# Altium project Nixie_Clock_2_1.PrjPcb
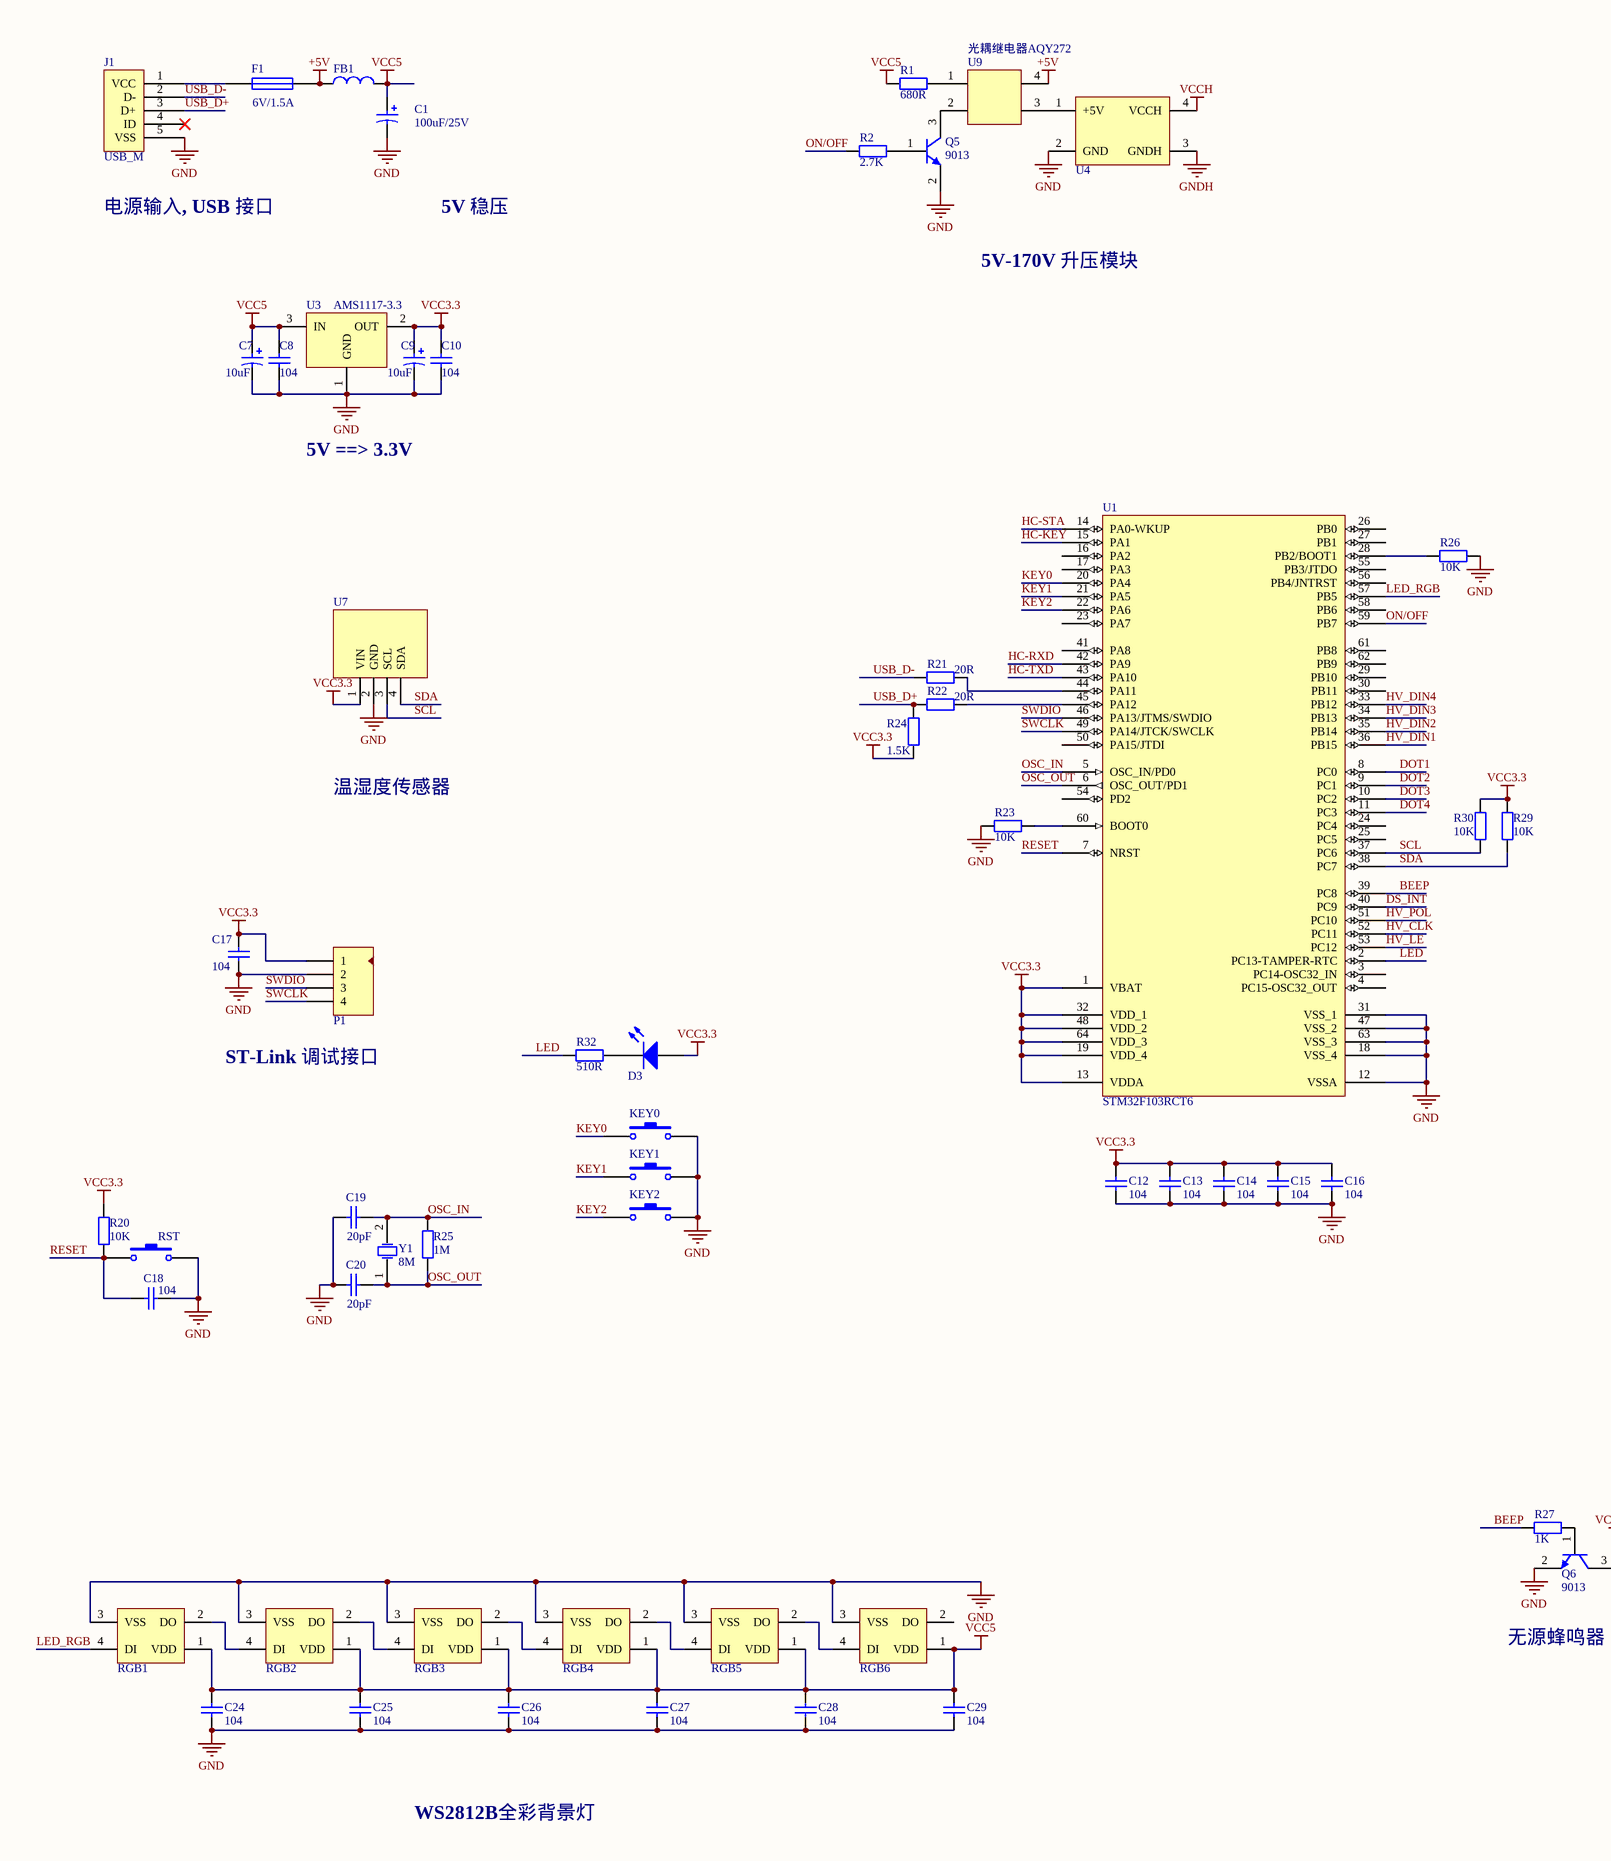
[diagram p0: SCH.SchDoc, left]
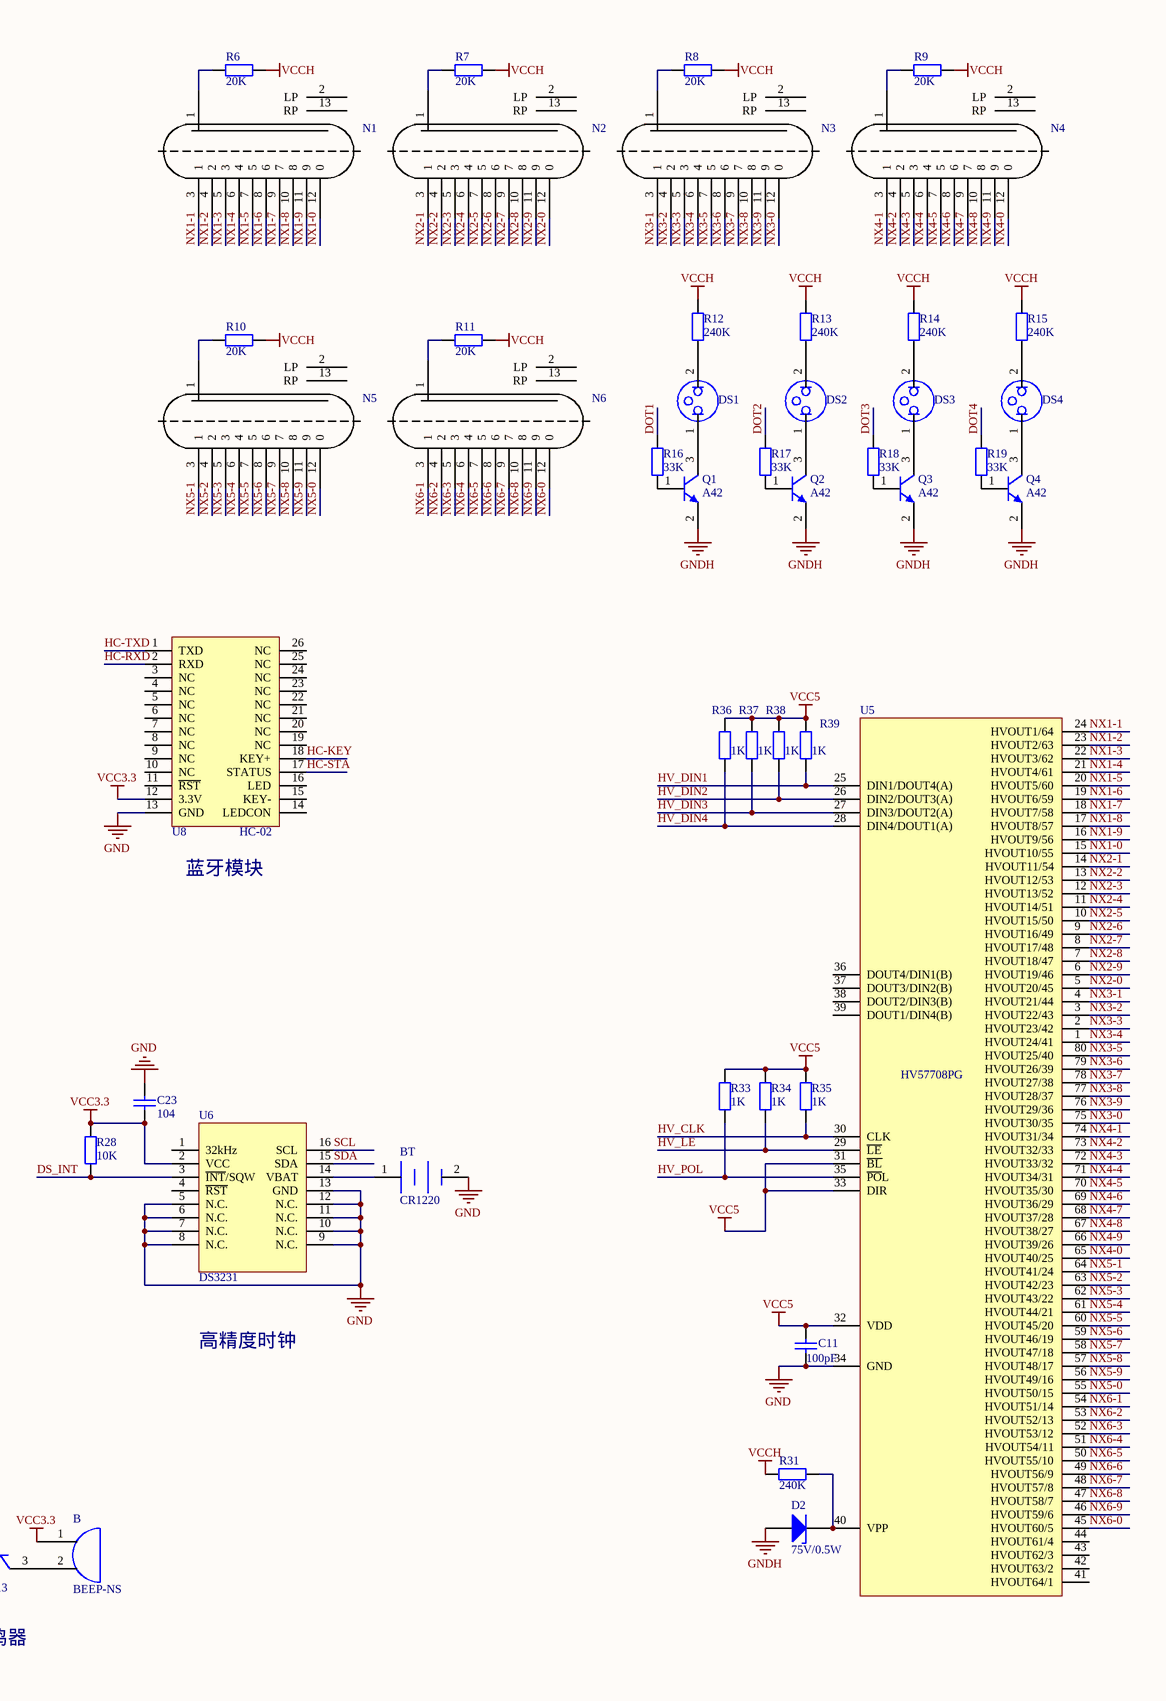
[diagram p1: SCH.SchDoc, right]
1 sheet, 101 parts. Net scope: global (net labels, ports and power ports of the same name join across sheets).
Board file: PCB.PcbDoc

## Sheet SCH.SchDoc
size A2

### Parts
B  BEEP-NS  [BEEP-NS]
BT  Battery  [CR1220]  (value not drawn)
C1  value 100uF/25V  [C-RB-SMD6.3x7.7]  (hidden comment: Cap-Pol-ES)
C7  value 10uF  [C-1210]  (hidden comment: Cap-Pol)
C8  value 104  [C-0805]  (hidden comment: Cap-S)
C9  value 10uF  [C-1210]  (hidden comment: Cap-Pol)
C10  value 104  [C-0805]  (hidden comment: Cap-S)
C11  value 100pF  [C-0805]  (hidden comment: Cap-S)
C12  value 104  [C-0805]  (hidden comment: Cap-S)
C13  value 104  [C-0805]  (hidden comment: Cap-S)
C14  value 104  [C-0805]  (hidden comment: Cap-S)
C15  value 104  [C-0805]  (hidden comment: Cap-S)
C16  value 104  [C-0805]  (hidden comment: Cap-S)
C17  value 104  [C-0805]  (hidden comment: Cap-S)
C18  value 104  [C-0805]  (hidden comment: Cap-S)
C19  value 20pF  [C-0805]  (hidden comment: Cap-S)
C20  value 20pF  [C-0805]  (hidden comment: Cap-S)
C23  value 104  [C-0805]  (hidden comment: Cap-S)
C24  value 104  [C-0805]  (hidden comment: Cap-S)
C25  value 104  [C-0805]  (hidden comment: Cap-S)
C26  value 104  [C-0805]  (hidden comment: Cap-S)
C27  value 104  [C-0805]  (hidden comment: Cap-S)
C28  value 104  [C-0805]  (hidden comment: Cap-S)
C29  value 104  [C-0805]  (hidden comment: Cap-S)
D2  value 75V/0.5W  [D-ll34]  (hidden comment: ZMM75)
D3  LED0  [LED-0805]  (value not drawn)
DS1  Neon  [PIN2]  (value not drawn)
DS2  Neon  [PIN2]  (value not drawn)
DS3  Neon  [PIN2]  (value not drawn)
DS4  Neon  [PIN2]  (value not drawn)
F1  value 6V/1.5A  [1206]  (hidden comment: Fuse1)
FB1  Inductor  [0805-1]  (value not drawn)
J1  USB_M  [USB_MICRO]
KEY0  KEY  [SW_PB2_C1]  (value not drawn)
KEY1  KEY  [SW_PB2_C1]  (value not drawn)
KEY2  KEY  [SW_PB2_C1]  (value not drawn)
N1  IN_14  [IN_14]  (value not drawn)
N2  IN_14  [IN_14]  (value not drawn)
N3  IN_14  [IN_14]  (value not drawn)
N4  IN_14  [IN_14]  (value not drawn)
N5  IN_14  [IN_14]  (value not drawn)
N6  IN_14  [IN_14]  (value not drawn)
P1  Header 4  [HDR4X1-2.54]  (value not drawn)
Q1  A42  [SOT23-3]
Q2  A42  [SOT23-3]
Q3  A42  [SOT23-3]
Q4  A42  [SOT23-3]
Q5  9013  [SOT23-3]
Q6  9013  [SOT23-3]
R1  value 680R  [0805-1]  (hidden comment: Res1)
R2  value 2.7K  [0805-1]  (hidden comment: Res1)
R6  value 20K  [0805-1]  (hidden comment: Res1)
R7  value 20K  [0805-1]  (hidden comment: Res1)
R8  value 20K  [0805-1]  (hidden comment: Res1)
R9  value 20K  [0805-1]  (hidden comment: Res1)
R10  value 20K  [0805-1]  (hidden comment: Res1)
R11  value 20K  [0805-1]  (hidden comment: Res1)
R12  value 240K  [0805-1]  (hidden comment: Res1)
R13  value 240K  [0805-1]  (hidden comment: Res1)
R14  value 240K  [0805-1]  (hidden comment: Res1)
R15  value 240K  [0805-1]  (hidden comment: Res1)
R16  value 33K  [0805-1]  (hidden comment: Res1)
R17  value 33K  [0805-1]  (hidden comment: Res1)
R18  value 33K  [0805-1]  (hidden comment: Res1)
R19  value 33K  [0805-1]  (hidden comment: Res1)
R20  value 10K  [0805-1]  (hidden comment: Res1)
R21  value 20R  [0805-1]  (hidden comment: Res1)
R22  value 20R  [0805-1]  (hidden comment: Res1)
R23  value 10K  [0805-1]  (hidden comment: Res1)
R24  value 1.5K  [0805-1]  (hidden comment: Res1)
R25  value 1M  [0805-1]  (hidden comment: Res1)
R26  value 10K  [0805-1]  (hidden comment: Res1)
R27  value 1K  [0805-1]  (hidden comment: Res1)
R28  value 10K  [0805-1]  (hidden comment: Res1)
R29  value 10K  [0805-1]  (hidden comment: Res1)
R30  value 10K  [0805-1]  (hidden comment: Res1)
R31  value 240K  [0805-1]  (hidden comment: Res1)
R32  value 510R  [0805-1]  (hidden comment: Res1)
R33  value 1K  [0805-1]  (hidden comment: Res1)
R34  value 1K  [0805-1]  (hidden comment: Res1)
R35  value 1K  [0805-1]  (hidden comment: Res1)
R36  value 1K  [0805-1]  (hidden comment: Res1)
R37  value 1K  [0805-1]  (hidden comment: Res1)
R38  value 1K  [0805-1]  (hidden comment: Res1)
R39  value 1K  [0805-1]  (hidden comment: Res1)
RGB1  WS2812B  [SMD-5050-4]  (value not drawn)
RGB2  WS2812B  [SMD-5050-4]  (value not drawn)
RGB3  WS2812B  [SMD-5050-4]  (value not drawn)
RGB4  WS2812B  [SMD-5050-4]  (value not drawn)
RGB5  WS2812B  [SMD-5050-4]  (value not drawn)
RGB6  WS2812B  [SMD-5050-4]  (value not drawn)
RST  SW-PB  [SW_PB2_A1]  (value not drawn)
U1  STM32F103RCT6  [LQFP-64]
U3  AMS1117-3.3  [SOT223]
U4  Boost  [BOOST-A]  (value not drawn)
U5  HV57708PG  [PQFP-80]
U6  DS3231  [SOIC-16W]
U7  SHT30  [SHT30]  (value not drawn)
U8  HC-02  [HC-02]
U9  光耦继电器AQY272  [AQY272-SOP]
Y1  value 8M  [X-SM49]  (hidden comment: XTAL)

### Nets
+5V: F1.2 FB1.1 U9.4
GND: BT.2 C1.2 C7.2 C8.2 C9.2 C10.2 C11.2 C12.1 C13.1 C14.1 C15.1 C16.1 C17.2 C18.2 C19.1 C20.1 C23.2 C24.2 C25.2 C26.2 C27.2 C28.2 C29.2 J1.5(VSS) KEY0.2 KEY1.2 KEY2.2 P1.2 Q5.2(E) Q6.2(E) R23.1 R26.2 RGB1.3(VSS) RGB2.3(VSS) RGB3.3(VSS) RGB4.3(VSS) RGB5.3(VSS) RGB6.3(VSS) RST.2 U1.12(VSSA) U1.18(VSS_4) U1.31(VSS_1) U1.47(VSS_2) U1.63(VSS_3) U3.1(GND) U4.2(GND) U5.34(GND) U6.5(N.C.) U6.6(N.C.) U6.7(N.C.) U6.8(N.C.) U6.9(N.C.) U6.10(N.C.) U6.11(N.C.) U6.12(N.C.) U6.13(GND) U7.2(GND) U8.13(GND)
GNDH: D2.1(A) Q1.2(E) Q2.2(E) Q3.2(E) Q4.2(E) U4.3(GNDH)
VCC3.3: B.1 C9.1 C10.1 C12.2 C13.2 C14.2 C15.2 C16.2 C17.1 C23.1 D3.1(A) P1.1 R20.2 R24.2 R28.2 R29.2 R30.2 U1.1(VBAT) U1.13(VDDA) U1.19(VDD_4) U1.32(VDD_1) U1.48(VDD_2) U1.64(VDD_3) U3.2(OUT) U6.2(VCC) U7.1(VIN) U8.12(3.3V)
VCC5: C1.1 C7.1 C8.1 C11.1 C24.1 C25.1 C26.1 C27.1 C28.1 C29.1 FB1.2 R1.1 R33.2 R34.2 R35.2 R36.2 R37.2 R38.2 R39.2 RGB1.1(VDD) RGB2.1(VDD) RGB3.1(VDD) RGB4.1(VDD) RGB5.1(VDD) RGB6.1(VDD) U3.3(IN) U5.31(~{BL}) U5.32(VDD) U5.33(DIR)
VCCH: R6.2 R7.2 R8.2 R9.2 R10.2 R11.2 R12.1 R13.1 R14.2 R15.1 R31.1 U4.4(VCCH)
BEEP: R27.1 U1.39(PC8)
DOT1: R16.1 U1.8(PC0)
DOT2: R17.1 U1.9(PC1)
DOT3: R18.1 U1.10(PC2)
DOT4: R19.1 U1.11(PC3)
DS_INT: R28.1 U1.40(PC9) U6.3(~{INT}/SQW)
HC-KEY: U1.15(PA1) U8.18(KEY+)
HC-RXD: U1.42(PA9) U8.2(RXD)
HC-STA: U1.14(PA0-WKUP) U8.17(STATUS)
HC-TXD: U1.43(PA10) U8.1(TXD)
HV_CLK: R35.1 U1.52(PC11) U5.30(CLK)
HV_DIN1: R39.1 U1.36(PB15) U5.25(DIN1/DOUT4(A))
HV_DIN2: R38.1 U1.35(PB14) U5.26(DIN2/DOUT3(A))
HV_DIN3: R37.1 U1.34(PB13) U5.27(DIN3/DOUT2(A))
HV_DIN4: R36.1 U1.33(PB12) U5.28(DIN4/DOUT1(A))
HV_LE: R34.1 U1.53(PC12) U5.29(~{LE})
HV_POL: R33.1 U1.51(PC10) U5.35(~{PO}L)
KEY0: KEY0.1 U1.20(PA4)
KEY1: KEY1.1 U1.21(PA5)
KEY2: KEY2.1 U1.22(PA6)
LED: R32.1 U1.2(PC13-TAMPER-RTC)
LED_RGB: RGB1.4(DI) U1.57(PB5)
NX1-0: N1.12(0) U5.15(HVOUT10/55)
NX1-1: N1.3(1) U5.24(HVOUT1/64)
NX1-2: N1.4(2) U5.23(HVOUT2/63)
NX1-3: N1.5(3) U5.22(HVOUT3/62)
NX1-4: N1.6(4) U5.21(HVOUT4/61)
NX1-5: N1.7(5) U5.20(HVOUT5/60)
NX1-6: N1.8(6) U5.19(HVOUT6/59)
NX1-7: N1.9(7) U5.18(HVOUT7/58)
NX1-8: N1.10(8) U5.17(HVOUT8/57)
NX1-9: N1.11(9) U5.16(HVOUT9/56)
NX2-0: N2.12(0) U5.5(HVOUT20/45)
NX2-1: N2.3(1) U5.14(HVOUT11/54)
NX2-2: N2.4(2) U5.13(HVOUT12/53)
NX2-3: N2.5(3) U5.12(HVOUT13/52)
NX2-4: N2.6(4) U5.11(HVOUT14/51)
NX2-5: N2.7(5) U5.10(HVOUT15/50)
NX2-6: N2.8(6) U5.9(HVOUT16/49)
NX2-7: N2.9(7) U5.8(HVOUT17/48)
NX2-8: N2.10(8) U5.7(HVOUT18/47)
NX2-9: N2.11(9) U5.6(HVOUT19/46)
NX3-0: N3.12(0) U5.75(HVOUT30/35)
NX3-1: N3.3(1) U5.4(HVOUT21/44)
NX3-2: N3.4(2) U5.3(HVOUT22/43)
NX3-3: N3.5(3) U5.2(HVOUT23/42)
NX3-4: N3.6(4) U5.1(HVOUT24/41)
NX3-5: N3.7(5) U5.80(HVOUT25/40)
NX3-6: N3.8(6) U5.79(HVOUT26/39)
NX3-7: N3.9(7) U5.78(HVOUT27/38)
NX3-8: N3.10(8) U5.77(HVOUT28/37)
NX3-9: N3.11(9) U5.76(HVOUT29/36)
NX4-0: N4.12(0) U5.65(HVOUT40/25)
NX4-1: N4.3(1) U5.74(HVOUT31/34)
NX4-2: N4.4(2) U5.73(HVOUT32/33)
NX4-3: N4.5(3) U5.72(HVOUT33/32)
NX4-4: N4.6(4) U5.71(HVOUT34/31)
NX4-5: N4.7(5) U5.70(HVOUT35/30)
NX4-6: N4.8(6) U5.69(HVOUT36/29)
NX4-7: N4.9(7) U5.68(HVOUT37/28)
NX4-8: N4.10(8) U5.67(HVOUT38/27)
NX4-9: N4.11(9) U5.66(HVOUT39/26)
NX5-0: N5.12(0) U5.55(HVOUT50/15)
NX5-1: N5.3(1) U5.64(HVOUT41/24)
NX5-2: N5.4(2) U5.63(HVOUT42/23)
NX5-3: N5.5(3) U5.62(HVOUT43/22)
NX5-4: N5.6(4) U5.61(HVOUT44/21)
NX5-5: N5.7(5) U5.60(HVOUT45/20)
NX5-6: N5.8(6) U5.59(HVOUT46/19)
NX5-7: N5.9(7) U5.58(HVOUT47/18)
NX5-8: N5.10(8) U5.57(HVOUT48/17)
NX5-9: N5.11(9) U5.56(HVOUT49/16)
NX6-0: N6.12(0) U5.45(HVOUT60/5)
NX6-1: N6.3(1) U5.54(HVOUT51/14)
NX6-2: N6.4(2) U5.53(HVOUT52/13)
NX6-3: N6.5(3) U5.52(HVOUT53/12)
NX6-4: N6.6(4) U5.51(HVOUT54/11)
NX6-5: N6.7(5) U5.50(HVOUT55/10)
NX6-6: N6.8(6) U5.49(HVOUT56/9)
NX6-7: N6.9(7) U5.48(HVOUT57/8)
NX6-8: N6.10(8) U5.47(HVOUT58/7)
NX6-9: N6.11(9) U5.46(HVOUT59/6)
ON/OFF: R2.2 U1.59(PB7)
OSC_IN: C19.2 R25.2 U1.5(OSC_IN/PD0) Y1.2(OSC2)
OSC_OUT: C20.2 R25.1 U1.6(OSC_OUT/PD1) Y1.1(OSC1)
RESET: C18.1 R20.1 RST.1 U1.7(NRST)
SCL: R30.1 U1.37(PC6) U6.16(SCL) U7.3(SCL)
SDA: R29.1 U1.38(PC7) U6.15(SDA) U7.4(SDA)
SWCLK: P1.4 U1.49(PA14/JTCK/SWCLK)
SWDIO: P1.3 U1.46(PA13/JTMS/SWDIO)
USB_D+: J1.3(D+) R22.1 R24.1
USB_D-: J1.2(D-) R21.1
NetB_2: B.2 Q6.3(C)
NetBT_1: BT.1 U6.14(VBAT)
NetD2_2: D2.2(K) R31.2 U5.40(VPP)
NetD3_2: D3.2(K) R32.2
NetDS1_1: DS1.1 Q1.3(C)
NetDS1_2: DS1.2 R12.2
NetDS2_1: DS2.1 Q2.3(C)
NetDS2_2: DS2.2 R13.2
NetDS3_1: DS3.1 Q3.3(C)
NetDS3_2: DS3.2 R14.1
NetDS4_1: DS4.1 Q4.3(C)
NetDS4_2: DS4.2 R15.2
NetF1_1: F1.1 J1.1(VCC)
NetN1_1: N1.1(VCC) R6.1
NetN2_1: N2.1(VCC) R7.1
NetN3_1: N3.1(VCC) R8.1
NetN4_1: N4.1(VCC) R9.1
NetN5_1: N5.1(VCC) R10.1
NetN6_1: N6.1(VCC) R11.1
NetQ1_1: Q1.1(B) R16.2
NetQ2_1: Q2.1(B) R17.2
NetQ3_1: Q3.1(B) R18.2
NetQ4_1: Q4.1(B) R19.2
NetQ5_1: Q5.1(B) R2.1
NetQ5_3: Q5.3(C) U9.2
NetQ6_1: Q6.1(B) R27.2
NetR1_2: R1.2 U9.1
NetR21_2: R21.2 U1.44(PA11)
NetR22_2: R22.2 U1.45(PA12)
NetR23_2: R23.2 U1.60(BOOT0)
NetR26_1: R26.1 U1.28(PB2/BOOT1)
NetRGB1_2: RGB1.2(DO) RGB2.4(DI)
NetRGB2_2: RGB2.2(DO) RGB3.4(DI)
NetRGB3_2: RGB3.2(DO) RGB4.4(DI)
NetRGB4_2: RGB4.2(DO) RGB5.4(DI)
NetRGB5_2: RGB5.2(DO) RGB6.4(DI)
NetU4_1: U4.1(+5V) U9.3

Not connected (* = marked no-connect by the designer): J1 4(ID)*; N1 2(LP) 13(RP); N2 2(LP) 13(RP); N3 2(LP) 13(RP); N4 2(LP) 13(RP); N5 2(LP) 13(RP); N6 2(LP) 13(RP); RGB6 2(DO); U1 3(PC14-OSC32_IN) 4(PC15-OSC32_OUT) 16(PA2) 17(PA3) 23(PA7) 24(PC4) 25(PC5) 26(PB0) 27(PB1) 29(PB10) 30(PB11) 41(PA8) 50(PA15/JTDI) 54(PD2) 55(PB3/JTDO) 56(PB4/JNTRST) 58(PB6) 61(PB8) 62(PB9); U5 36(DOUT4/DIN1(B)) 37(DOUT3/DIN2(B)) 38(DOUT2/DIN3(B)) 39(DOUT1/DIN4(B)) 41(HVOUT64/1) 42(HVOUT63/2) 43(HVOUT62/3) 44(HVOUT61/4); U6 1(32kHz) 4(~{RST}); U8 3(NC) 4(NC) 5(NC) 6(NC) 7(NC) 8(NC) 9(NC) 10(NC) 11(~{RST}) 14(LEDCON) 15(KEY-) 16(LED) 19(NC) 20(NC) 21(NC) 22(NC) 23(NC) 24(NC) 25(NC) 26(NC)

### Notes on the sheet
- 电源输入, USB 接口
- 5V 稳压
- 5V-170V 升压模块
- 5V ==> 3.3V
- 温湿度传感器
- (near U8) 蓝牙模块
- (near P1) ST-Link 调试接口
- 高精度时钟
- 无源蜂鸣器
- WS2812B全彩背景灯

### Library data of the parts
B = BEEP-NS: 无源蜂鸣器
C1 = Cap-Pol-ES: 贴片铝电解电容; Published: 8-Jun-2000; LatestRevisionDate: 17-Jul-2002; LatestRevisionNote: Re-released for DXP Platform.; PackageReference: RB7.6-15; Publisher: Altium Limited
C7 C9 = Cap-Pol-A: 钽电容; Published: 8-Jun-2000; LatestRevisionDate: 17-Jul-2002; LatestRevisionNote: Re-released for DXP Platform.; PackageReference: RB7.6-15; Publisher: Altium Limited
C8 C10-C20 C23-C29 = Cap-S: 贴片瓷片电容; Published: 8-Jun-2000; LatestRevisionDate: 17-Jul-2002; LatestRevisionNote: Re-released for DXP Platform.; PackageReference: RAD-0.3; Publisher: Altium Limited
D2 = Diode-Z: 稳压二极管; Published: 8-Jun-2000; LatestRevisionDate: 17-Jul-2002; LatestRevisionNote: Re-released for DXP Platform.; PackageReference: SMB; Publisher: Altium Limited; Code_JEDEC: DO-214-AA
D3 = LED0: 发光二极管; Published: 8-Jun-2000; LatestRevisionDate: 08-Jul-2005; LatestRevisionNote: Mech Layer 1 removed.; PackageReference: LED-0; Publisher: Altium Limited
DS1-DS4 = Neon_Lamp: 氖泡
F1 = Fuse1: 保险丝
FB1 = Inductor: 磁珠; Code_IEC: 1005; Published: 8-Jun-2000; LatestRevisionDate: 17-Jul-2002; LatestRevisionNote: Re-released for DXP Platform.; PackageReference: 0402-A; Publisher: Altium Limited; Code_JEITA: 0402
J1 = USB_M: Micro/Mini USB
KEY0-KEY2 RST = SW-PB: 微动开关; Published: 24-Mar-1999; LatestRevisionDate: 17-Jul-2002; LatestRevisionNote: Re-released for DXP Platform.; PackageReference: SPST-2; Publisher: Altium Limited
N1-N6 = IN_14: 辉光管
P1 = Header 4: 接插件; LatestRevisionDate: 17-Jul-2002; LatestRevisionNote: Re-released for DXP Platform.; Publisher: Altium Limited
Q1-Q6 = NPN1: 贴片三极管; Published: 8-Jun-2000; LatestRevisionDate: 15-Jan-2003; LatestRevisionNote: PCB Footprint 'BCY-W3/D4.7' replaced; PackageReference: TO-92A; Publisher: Altium Limited; DatasheetDocument: 1997; PackageDocument: Sep-1998; Code_JEDEC: TO-92A; ComponentLink1Description: Manufacturer Link; ComponentLink1URL: http://www.fairchildsemi.com/; ComponentLink2Description: Datasheet; ComponentLink2URL: http://www.fairchildsemi.com/ds/2N%2F2N3904.pdf
R1 R2 R6-R39 = Res1: 贴片电阻; Published: 8-Jun-2000; LatestRevisionDate: 17-Jul-2002; LatestRevisionNote: Re-released for DXP Platform.; PackageReference: AXIAL-0.4; Publisher: Altium Limited
RGB1-RGB6 = WS2812B: WS2812B 4脚RGB全彩LED
U1 = STM32F103RCT6: STM32F103, 64引脚, 256Kb Flash, 48Kb SRAM; Published: 30-May-2008; DatasheetVersion: rev6, Mar-2008; PackageVersion: Mar-2008; PackageReference: LQFP64; Publisher: Altium Limited; PackageDescription: 64-Pin Low-Profile Quad Flat Pack, 10 x 10 mm Body, 0.5 mm Pitch (LQFP64); ComponentLink1Description: Manufacturer Link; ComponentLink1URL: www.st.com/stm32; ComponentLink2Description: Datasheet; ComponentLink2URL: http://www.st.com/stonline/products/literature/ds/13587.pdf
U3 = AMS1117: 3.3V稳压芯片
U4 = 升压模块5V-170V: 5V-->170V
U5 = HV57708PG: 32MHz, 64通道推挽输出串入并出芯片
U6 = DS3231: 高精度时钟芯片
U7 = SHT30: 温湿度传感器模块
U8 = HC-02: 串口蓝牙4.0, 10m
U9 = RELAY-AQY272: 继电器
Y1 = XTAL: 晶振; Published: 8-Jun-2000; LatestRevisionDate: 17-Jul-2002; LatestRevisionNote: Re-released for DXP Platform.; PackageReference: R38; Publisher: Altium Limited
BT = Battery: type: CR1220